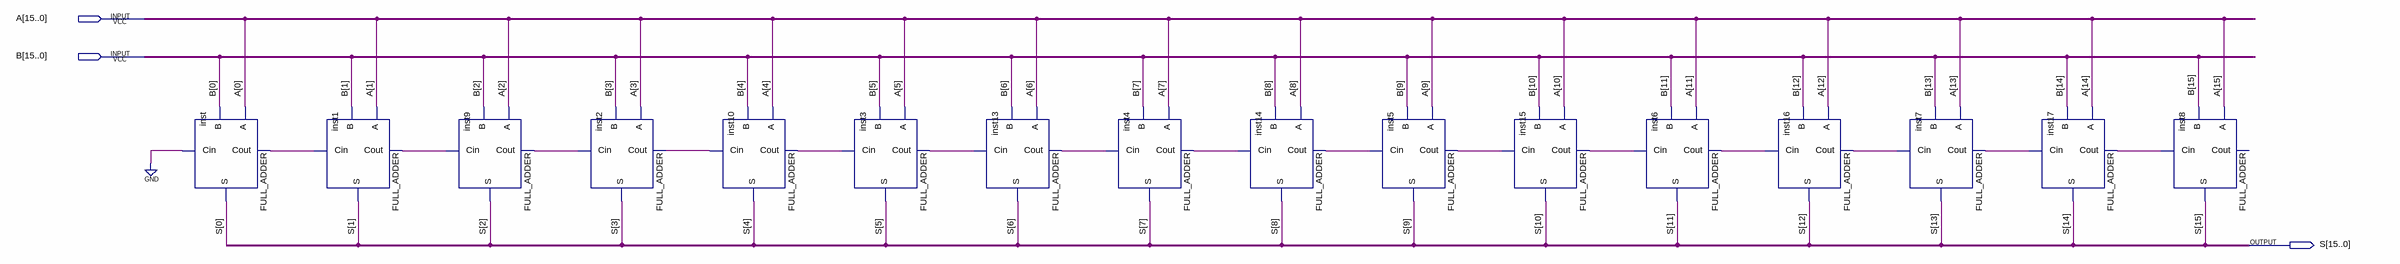
[diagram p0: schematic sheet]
// Quartus schematic ADD.bdf as structural Verilog: 16 symbols, 3 pins
module ADD (
  input  [15:0] A,
  input  [15:0] B,
  output [15:0] S
);

  wire inst1_cout, inst2_cout, inst3_cout, inst4_cout, inst5_cout, inst6_cout, inst7_cout, inst9_cout,
       inst10_cout, inst13_cout, inst14_cout, inst15_cout, inst16_cout, inst17_cout, inst_cout;

  FULL_ADDER inst (.A(A[0]), .B(B[0]), .Cin(1'b0), .S(S[0]), .Cout(inst_cout));
  FULL_ADDER inst1 (.A(A[1]), .B(B[1]), .Cin(inst_cout), .S(S[1]), .Cout(inst1_cout));
  FULL_ADDER inst9 (.A(A[2]), .B(B[2]), .Cin(inst1_cout), .S(S[2]), .Cout(inst9_cout));
  FULL_ADDER inst2 (.A(A[3]), .B(B[3]), .Cin(inst9_cout), .S(S[3]), .Cout(inst2_cout));
  FULL_ADDER inst10 (.A(A[4]), .B(B[4]), .Cin(inst2_cout), .S(S[4]), .Cout(inst10_cout));
  FULL_ADDER inst3 (.A(A[5]), .B(B[5]), .Cin(inst10_cout), .S(S[5]), .Cout(inst3_cout));
  FULL_ADDER inst13 (.A(A[6]), .B(B[6]), .Cin(inst3_cout), .S(S[6]), .Cout(inst13_cout));
  FULL_ADDER inst4 (.A(A[7]), .B(B[7]), .Cin(inst13_cout), .S(S[7]), .Cout(inst4_cout));
  FULL_ADDER inst14 (.A(A[8]), .B(B[8]), .Cin(inst4_cout), .S(S[8]), .Cout(inst14_cout));
  FULL_ADDER inst5 (.A(A[9]), .B(B[9]), .Cin(inst14_cout), .S(S[9]), .Cout(inst5_cout));
  FULL_ADDER inst15 (.A(A[10]), .B(B[10]), .Cin(inst5_cout), .S(S[10]), .Cout(inst15_cout));
  FULL_ADDER inst6 (.A(A[11]), .B(B[11]), .Cin(inst15_cout), .S(S[11]), .Cout(inst6_cout));
  FULL_ADDER inst16 (.A(A[12]), .B(B[12]), .Cin(inst6_cout), .S(S[12]), .Cout(inst16_cout));
  FULL_ADDER inst7 (.A(A[13]), .B(B[13]), .Cin(inst16_cout), .S(S[13]), .Cout(inst7_cout));
  FULL_ADDER inst17 (.A(A[14]), .B(B[14]), .Cin(inst7_cout), .S(S[14]), .Cout(inst17_cout));
  FULL_ADDER inst8 (.A(A[15]), .B(B[15]), .Cin(inst17_cout), .S(S[15]));  // open: Cout
endmodule
